# Altium project ESP_BATT_Board.PrjPcb
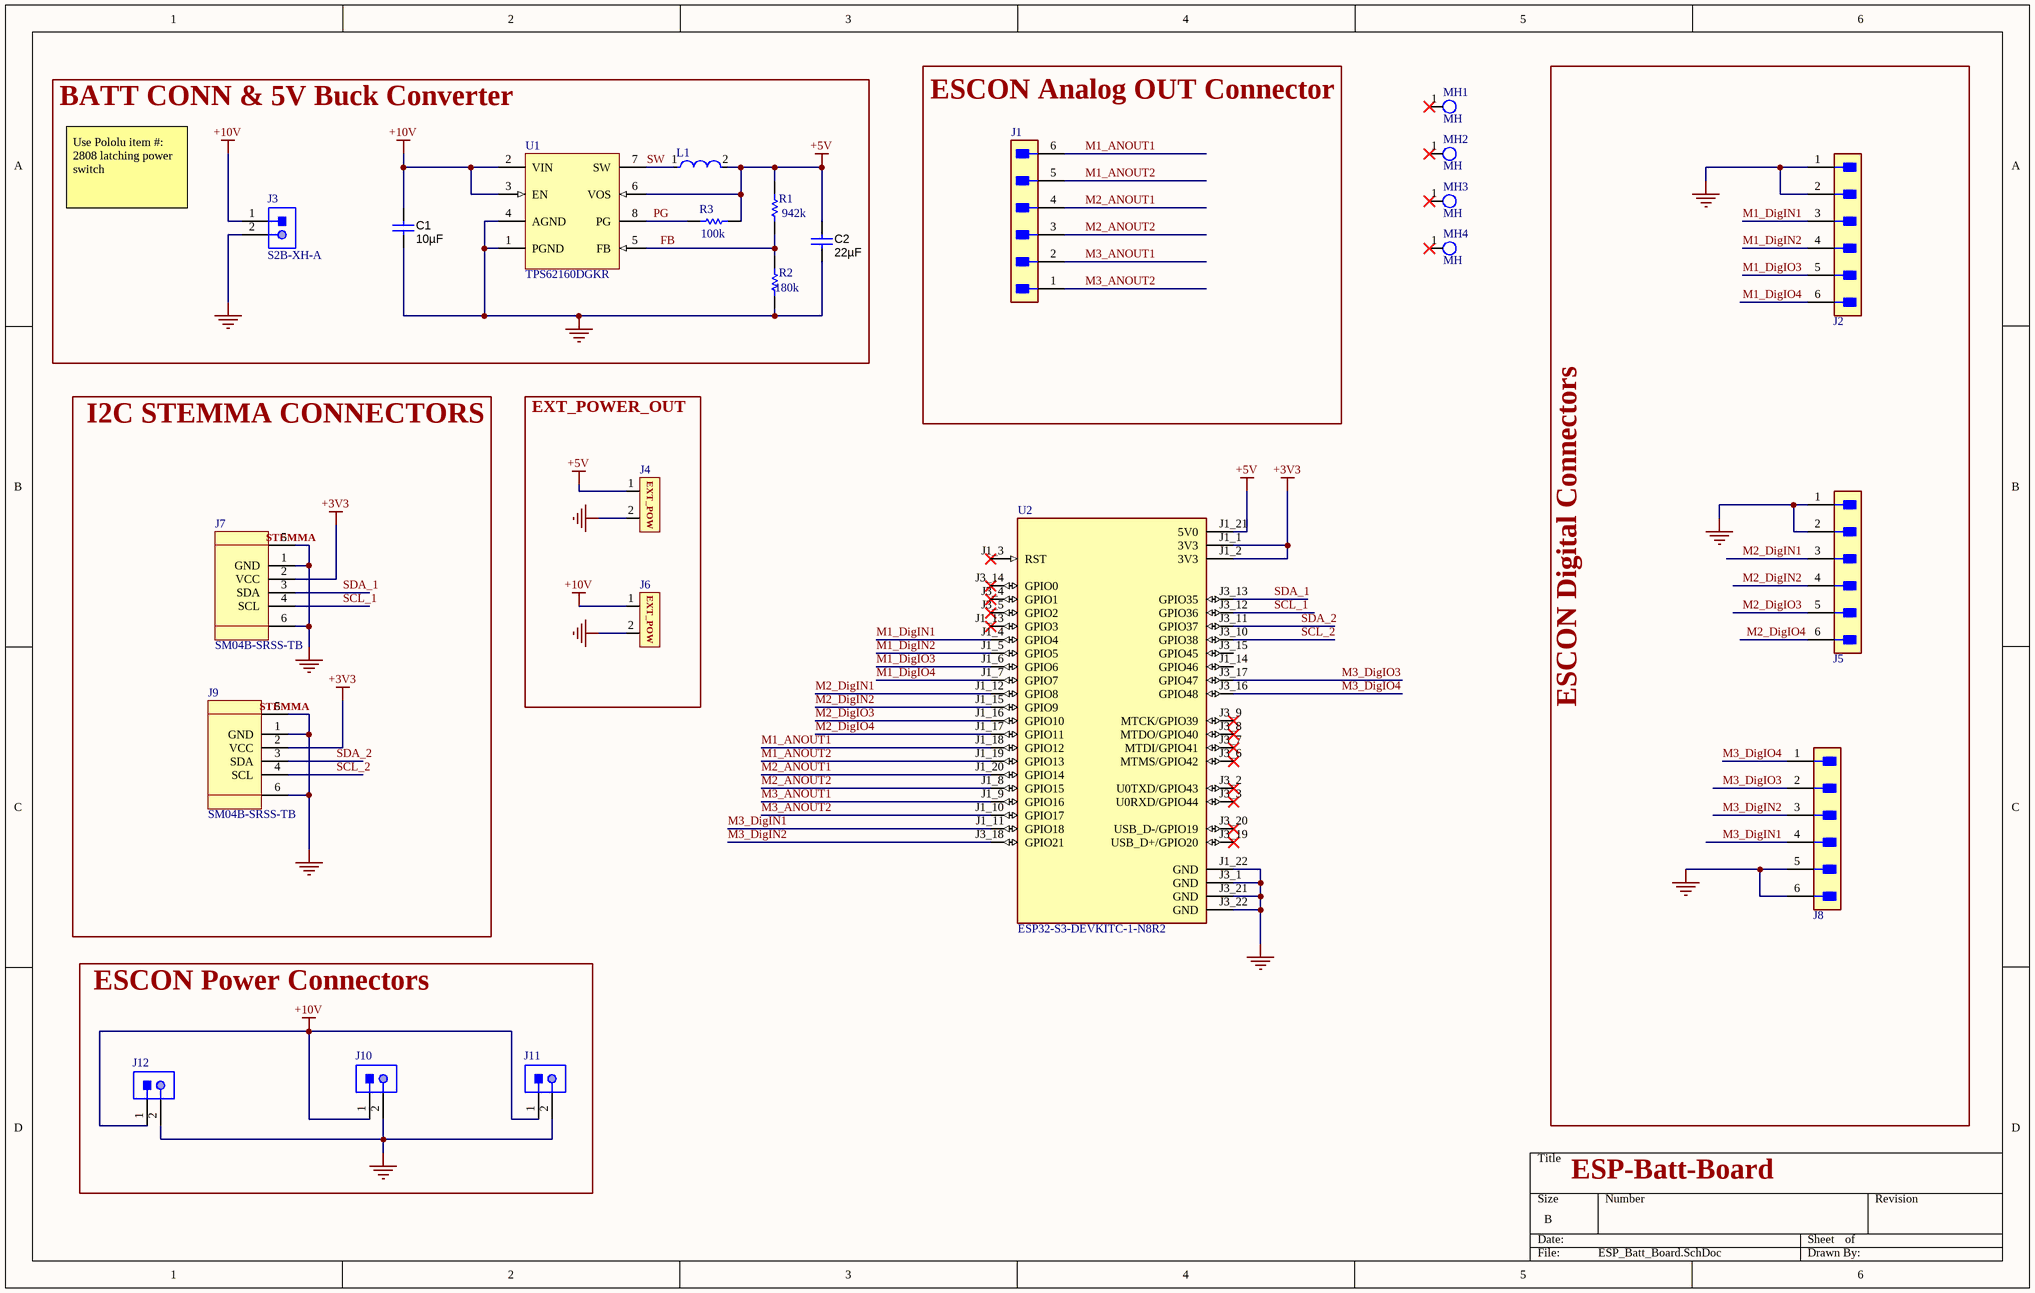
[diagram p0: ESP_Batt_Board.SchDoc]
1 sheet, 24 parts. Net scope: global (net labels, ports and power ports of the same name join across sheets).
Board file: PCB.PcbDoc

## Sheet ESP_Batt_Board.SchDoc
size B; SheetNumber: 1; SheetTotal: 1

### Parts
C1  ValueDisplayed: 10µF  [CAP_0805]  (hidden comment: C2012X5R1E106K125AB)
C2  ValueDisplayed: 22µF  [CAP_0805]  (hidden comment: GRM21BR61E226ME44)
J1  S6B-XH-A (LF)(SN)  [JST-XH-6PIN_RA]  (value not drawn)
J2  S6B-XH-A (LF)(SN)  [JST-XH-6PIN_RA]  (value not drawn)
J3  S2B-XH-A  [JST-S2B-XH-A(LF)(SN)_V]
J4  EXT_POWER_CONN  [POWER]  (value not drawn)  (no BOM)
J5  S6B-XH-A (LF)(SN)  [JST-XH-6PIN_RA]  (value not drawn)
J6  EXT_POWER_CONN  [POWER]  (value not drawn)  (no BOM)
J7  SM04B-SRSS-TB  [4PIN_STEMMA]
J8  S6B-XH-A (LF)(SN)  [JST-XH-6PIN_RA]  (value not drawn)
J9  SM04B-SRSS-TB  [4PIN_STEMMA]
J10  S2B-XH-A  [JST-S2B-XH-A(LF)(SN)_V]  (value not drawn)
J11  S2B-XH-A  [JST-S2B-XH-A(LF)(SN)_V]  (value not drawn)
J12  S2B-XH-A  [JST-S2B-XH-A(LF)(SN)_V]  (value not drawn)
L1  IHLP1212BZEZ2R2M1Z  [IND_1212]  (value not drawn)
MH1  MH  [M2_MTH]  (no BOM)
MH2  MH  [M2_MTH]  (no BOM)
MH3  MH  [M2_MTH]  (no BOM)
MH4  MH  [M2_MTH]  (no BOM)
R1  942k  [RES_0603]
R2  180k  [RES_0603]
R3  100k  [RES_0603]
U1  TPS62160DGKR  [DGK0008A_M]
U2  ESP32-S3-DEVKITC-1-N8R2  [XCVR_ESP32-S3-DEVKITC-1-N8R2]

### Blocks framed on the sheet
ESCON Analog OUT Connector: J1
ESCON Digital Connectors: J2 J5 J8
BATT CONN & 5V Buck Converter: C1 C2 J3 L1 R1-R3 U1
I2C STEMMA CONNECTORS: J7 J9
EXT_POWER_OUT: J4 J6
ESCON Power Connectors: J10-J12

### Nets
+3V3: J7.2(VCC) J9.2(VCC) U2.J1_1(3V3) U2.J1_2(3V3)
+5V: C2.1 J4.1 L1.2 R1.2 R3.2 U1.6(VOS) U2.J1_21(5V0)
+10V: C1.1 J3.1 J6.1 J10.1 J11.1 J12.1 U1.2(VIN) U1.3(EN)
GND: C1.2 C2.2 J2.1 J2.2 J3.2 J4.2 J5.1 J5.2 J6.2 J7.1(GND) J7.5 J7.6 J8.5 J8.6 J9.1(GND) J9.5 J9.6 J10.2 J11.2 J12.2 R2.1 U1.1(PGND) U1.4(AGND) U2.J1_22(GND) U2.J3_1(GND) U2.J3_21(GND) U2.J3_22(GND)
FB: R1.1 R2.2 U1.5(FB)
M1_ANOUT1: J1.6 U2.J1_18(GPIO12)
M1_ANOUT2: J1.5 U2.J1_19(GPIO13)
M1_DigIN1: J2.3 U2.J1_4(GPIO4)
M1_DigIN2: J2.4 U2.J1_5(GPIO5)
M1_DigIO3: J2.5 U2.J1_6(GPIO6)
M1_DigIO4: J2.6 U2.J1_7(GPIO7)
M2_ANOUT1: J1.4 U2.J1_20(GPIO14)
M2_ANOUT2: J1.3 U2.J1_8(GPIO15)
M2_DigIN1: J5.3 U2.J1_12(GPIO8)
M2_DigIN2: J5.4 U2.J1_15(GPIO9)
M2_DigIO3: J5.5 U2.J1_16(GPIO10)
M2_DigIO4: J5.6 U2.J1_17(GPIO11)
M3_ANOUT1: J1.2 U2.J1_9(GPIO16)
M3_ANOUT2: J1.1 U2.J1_10(GPIO17)
M3_DigIN1: J8.4 U2.J1_11(GPIO18)
M3_DigIN2: J8.3 U2.J3_18(GPIO21)
M3_DigIO3: J8.2 U2.J3_17(GPIO47)
M3_DigIO4: J8.1 U2.J3_16(GPIO48)
PG: R3.1 U1.8(PG)
SCL_1: J7.4(SCL) U2.J3_12(GPIO36)
SCL_2: J9.4(SCL) U2.J3_10(GPIO38)
SDA_1: J7.3(SDA) U2.J3_13(GPIO35)
SDA_2: J9.3(SDA) U2.J3_11(GPIO37)
SW: L1.1 U1.7(SW)

Not connected (* = marked no-connect by the designer): MH1 1*; MH2 1*; MH3 1*; MH4 1*; U2 J1_3(RST)* J1_13(GPIO3)* J1_14(GPIO46) J3_2(U0TXD/GPIO43)* J3_3(U0RXD/GPIO44)* J3_4(GPIO1)* J3_5(GPIO2)* J3_6(MTMS/GPIO42)* J3_7(MTDI/GPIO41)* J3_8(MTDO/GPIO40)* J3_9(MTCK/GPIO39)* J3_14(GPIO0)* J3_15(GPIO45) J3_19(USB_D+/GPIO20)* J3_20(USB_D-/GPIO19)*

### Notes on the sheet
- Use Pololu item #: 2808 latching power switch
- ESP-Batt-Board
- (in symbol EXT_POWER_CONN) EXT_POW
- (in symbol SM04B-SRSS-TB) STEMMA

### Library data of the parts
C1 = C2012X5R1E106K125AB: CAP, CERM, 10uF, 25V, +/-10%, X5R, 0805; Manufacturer: TDK; Polarized: N; CompType: Capacitor; U/M: EA; Cap_F: 0.00001; Tolerance_%: 10; Value1: Unknown; VDC_V: 25; TaMin_C: -55; TaMax_C: 85; Cap_Case: 0805; SymbolVersion: 2008-07-09; Value: 10uF; PartNumber: C2012X5R1E106K125AB; PackageReference: 0805; RoHS: Y; Value2: 25V; MountType: SMT; Technology: Ceramic; TempCo: X5R; Published: 2008-06-19; Publisher: Texas Instruments; LatestRevisionDate: 2014-06-25; ComponentLink1Description: Datasheet link; ComponentLink1URL: http://www.tdk.com/pdf/TDKMLCCCapRange.pdf; Supplier 1: Digi-Key; Supplier Part Number 1: 445-5984-1-ND
C2 = GRM21BR61E226ME44: CAP, CERM, 22 µF, 25 V, +/- 20%, X5R, 0805; Manufacturer: MuRata; CompType: Capacitor; Value: 22uF; Tolerance_%: 20; TaMax_C: 85; Cap_Case: 0805; PartNumber: GRM21BR61E226ME44; PackageReference: 0805; MountType: SMT; TempCo: X5R; Supplier 1: DigiKey; Supplier Part Number 1: 490-14661-1-ND
J1 J2 J5 J8 = S6B-XH-A (LF)(SN): CONN HEADER THT R/A 6POS 2.5MM; Number of Contacts: 6; Contact Resistance: 20mR; Max Current Rating: 3A; Max Voltage Rating (AC): 250V; Gender: Male; Insulation Resistance: 1GR; Wire/Cable Gauge: 22AWG; Fastening Type: Detent; Lead Pitch: 2.5mm; Flammability Rating: UL94 V-0; Contact Finish - Mating: TIN; Housing Material: Polyamide; Length: 17.4mm; Termination: Solder; Contact Type: Male Pin; Number of Positions: 6; Mount: Through Hole; Orientation: Right Angle; Voltage Rating (AC): 250V; Contact Shape: Square; Lead Free: Lead Free; Insulation Material: Nylon; Insulation Color: Natural; Contact Plating: Tin; Connector Type: Header; Housing Color: White; Color: Natural; Package Quantity: 500; Contact Material: Brass; Packaging: Bulk; Pitch: 2.5mm; Series: XH; Number of Rows: 1; Min Operating Temperature: -25°C; Voltage Rating: 250V; REACH SVHC: No SVHC; Current Rating: 3A; Depth: 11.5mm; Max Operating Temperature: 85°C
MH1-MH4 = M2_MTH
R1-R3 = RES_0603
  R1: Supplier 1: DigiKey; Supplier Part Number 1: 2019-RN73H1JTTD9423D25CT-ND; R: 942k
  R2: R: 180k; Supplier 1: Avnet; Supplier Part Number 1: RC0603FR-07180KL
  R3: Supplier 1: DigiKey; Supplier Part Number 1: 311-100KHRTR-ND
U1 = TPS62160DGKR: Buck Step Down Regulator with 3 to 17 V Input and 0.9 to 6 V Output, -40 to 85 degC, 8-Pin VSSOP (DGK), Green (RoHS & no Sb/Br); Manufacturer: Texas Instruments; Rating: Catalog; Iq(Typ)(mA): 0.017; Switch Current Limit(Typ)(A): 1.8; Vout(Min)(V): 0.9; Vin(Max)(V): 17; Vout(Max)(V): 6; Duty Cycle(Max)(%): 100; Regulated Outputs(#): 1; Synchronous Rectification: TRUE; SubFamily: Step-Down Regulator; Vin(Min)(V): 3; Code_JEDEC: MO-187-AA; PartNumber: TPS62160DGKR; DatasheetVersion: SLVSAM2A; ComponentLink1URL: http://www.ti.com/general/docs/lit/getliterature.tsp?genericPartNumber=TPS62160&fileType=pdf; Mounting Technology: Surface Mount; PackageDescription: 8-Pin Thin Small Outline Package 3 x 3 mm Body ,0.65 mm Pitch; PackageVersion: revE, May-2006; ComponentLink3URL: Samples URL:http://www.ti.com/product/tps62160#samples; ComponentLink2Description: Package Specification; ComponentLink3Description: URL Link1; Eco-Plan: Green (RoHS & no Sb/Br); ComponentLink1Description: Datasheet; ComponentLink2URL: http://www.ti.com/lit/ml/mpds028d/mpds028d.pdf; Iout(Max)(A): 1; PackageReference: DGK0008A; Topology: Buck
U2 = ESP32-S3-DEVKITC-1-N8R2: WiFi Development Tools - 802.11 (Engineering Samples Only) ESP32-S3 General-Purpose Development Board, ESP32-S3-WROOM-1-N8R2, with Pin Header; MF: Espressif Systems; SnapEDA_Link: https://www.snapeda.com/parts/ESP32-S3-DEVKITC-1-N8R2/Espressif+Systems/view-part/?ref=snap; Package: None; Value: *; MP: ESP32-S3-DEVKITC-1-N8R2; Check_prices: https://www.snapeda.com/parts/ESP32-S3-DEVKITC-1-N8R2/Espressif+Systems/view-part/?ref=eda